# Altium schematic sheet openmv-Layout.SchDoc
size Legal
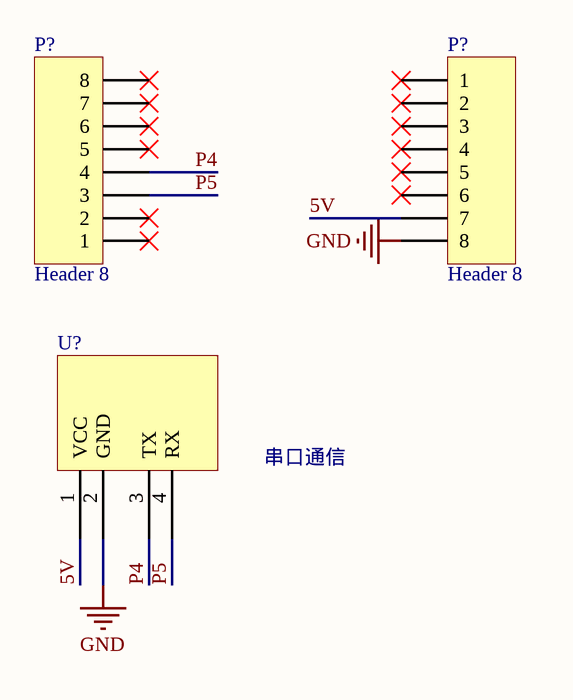
[diagram p0: openmv-Layout.SchDoc]

## Parts
(Parts that share a designator on the sheet are numbered #1, #2 ... from top to bottom, then left to right.)
P?#1  Header 8  [HDR1X8]
P?#2  Header 8  [HDR1X8]
U?  串口通信  [J-XH-4AW短]

## Nets
GND: P?#1.8 U?.2(GND)
5V: P?#1.7 U?.1(VCC)
P4: P?#2.4 U?.3(TX)
P5: P?#2.3 U?.4(RX)

Not connected (* = marked no-connect by the designer): P?#1 1* 2* 3* 4* 5* 6*; P?#2 1* 2* 5* 6* 7* 8*

## Library data of the parts
P?#1 P?#2 = Header 8: Header, 8-Pin; LatestRevisionDate: 17-Jul-2002; LatestRevisionNote: Re-released for DXP Platform.; Publisher: Altium Limited
U? = XH2.54插座-4P